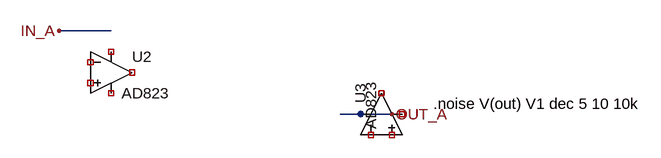
[diagram p0: schematic case_13.asc]
case_13.asc, the LTspice schematic file:
Version 4.1
SHEET 1 880 680
WIRE 320 224 240 224
WIRE 672 352 752 352
FLAG 240 224 IN_A
FLAG 752 352 OUT_A
SYMBOL OpAmps\AD823 320 224 R0
WINDOW 0 32 40 Left 2
SYMATTR InstName U2
SYMATTR Value AD823
SYMATTR Type opamp
SYMBOL OpAmps\AD823 672 352 R270
WINDOW 3 -24 48 Left 2
SYMATTR InstName U3
SYMATTR Value AD823
SYMATTR SpiceLine Vos=50u
TEXT 816 336 Left 2 !.noise V(out) V1 dec 5 10 10k

The netlist it stands for:
* case_13.asc
X§U2 NC_01 NC_02 NC_03 NC_04 NC_05 AD823  ; pins In+ In- V+ V- OUT
X§U3 NC_06 NC_07 OUT_A NC_08 NC_09 AD823 Vos=50u  ; pins In+ In- V+ V- OUT
.noise V(out) V1 dec 5 10 10k
.lib ADI.lib
.backanno
.end